# Altium schematic sheet MCU_STM32F407.SchDoc
size A3; DocumentNumber: 7; SheetNumber: 6; SheetTotal: 6
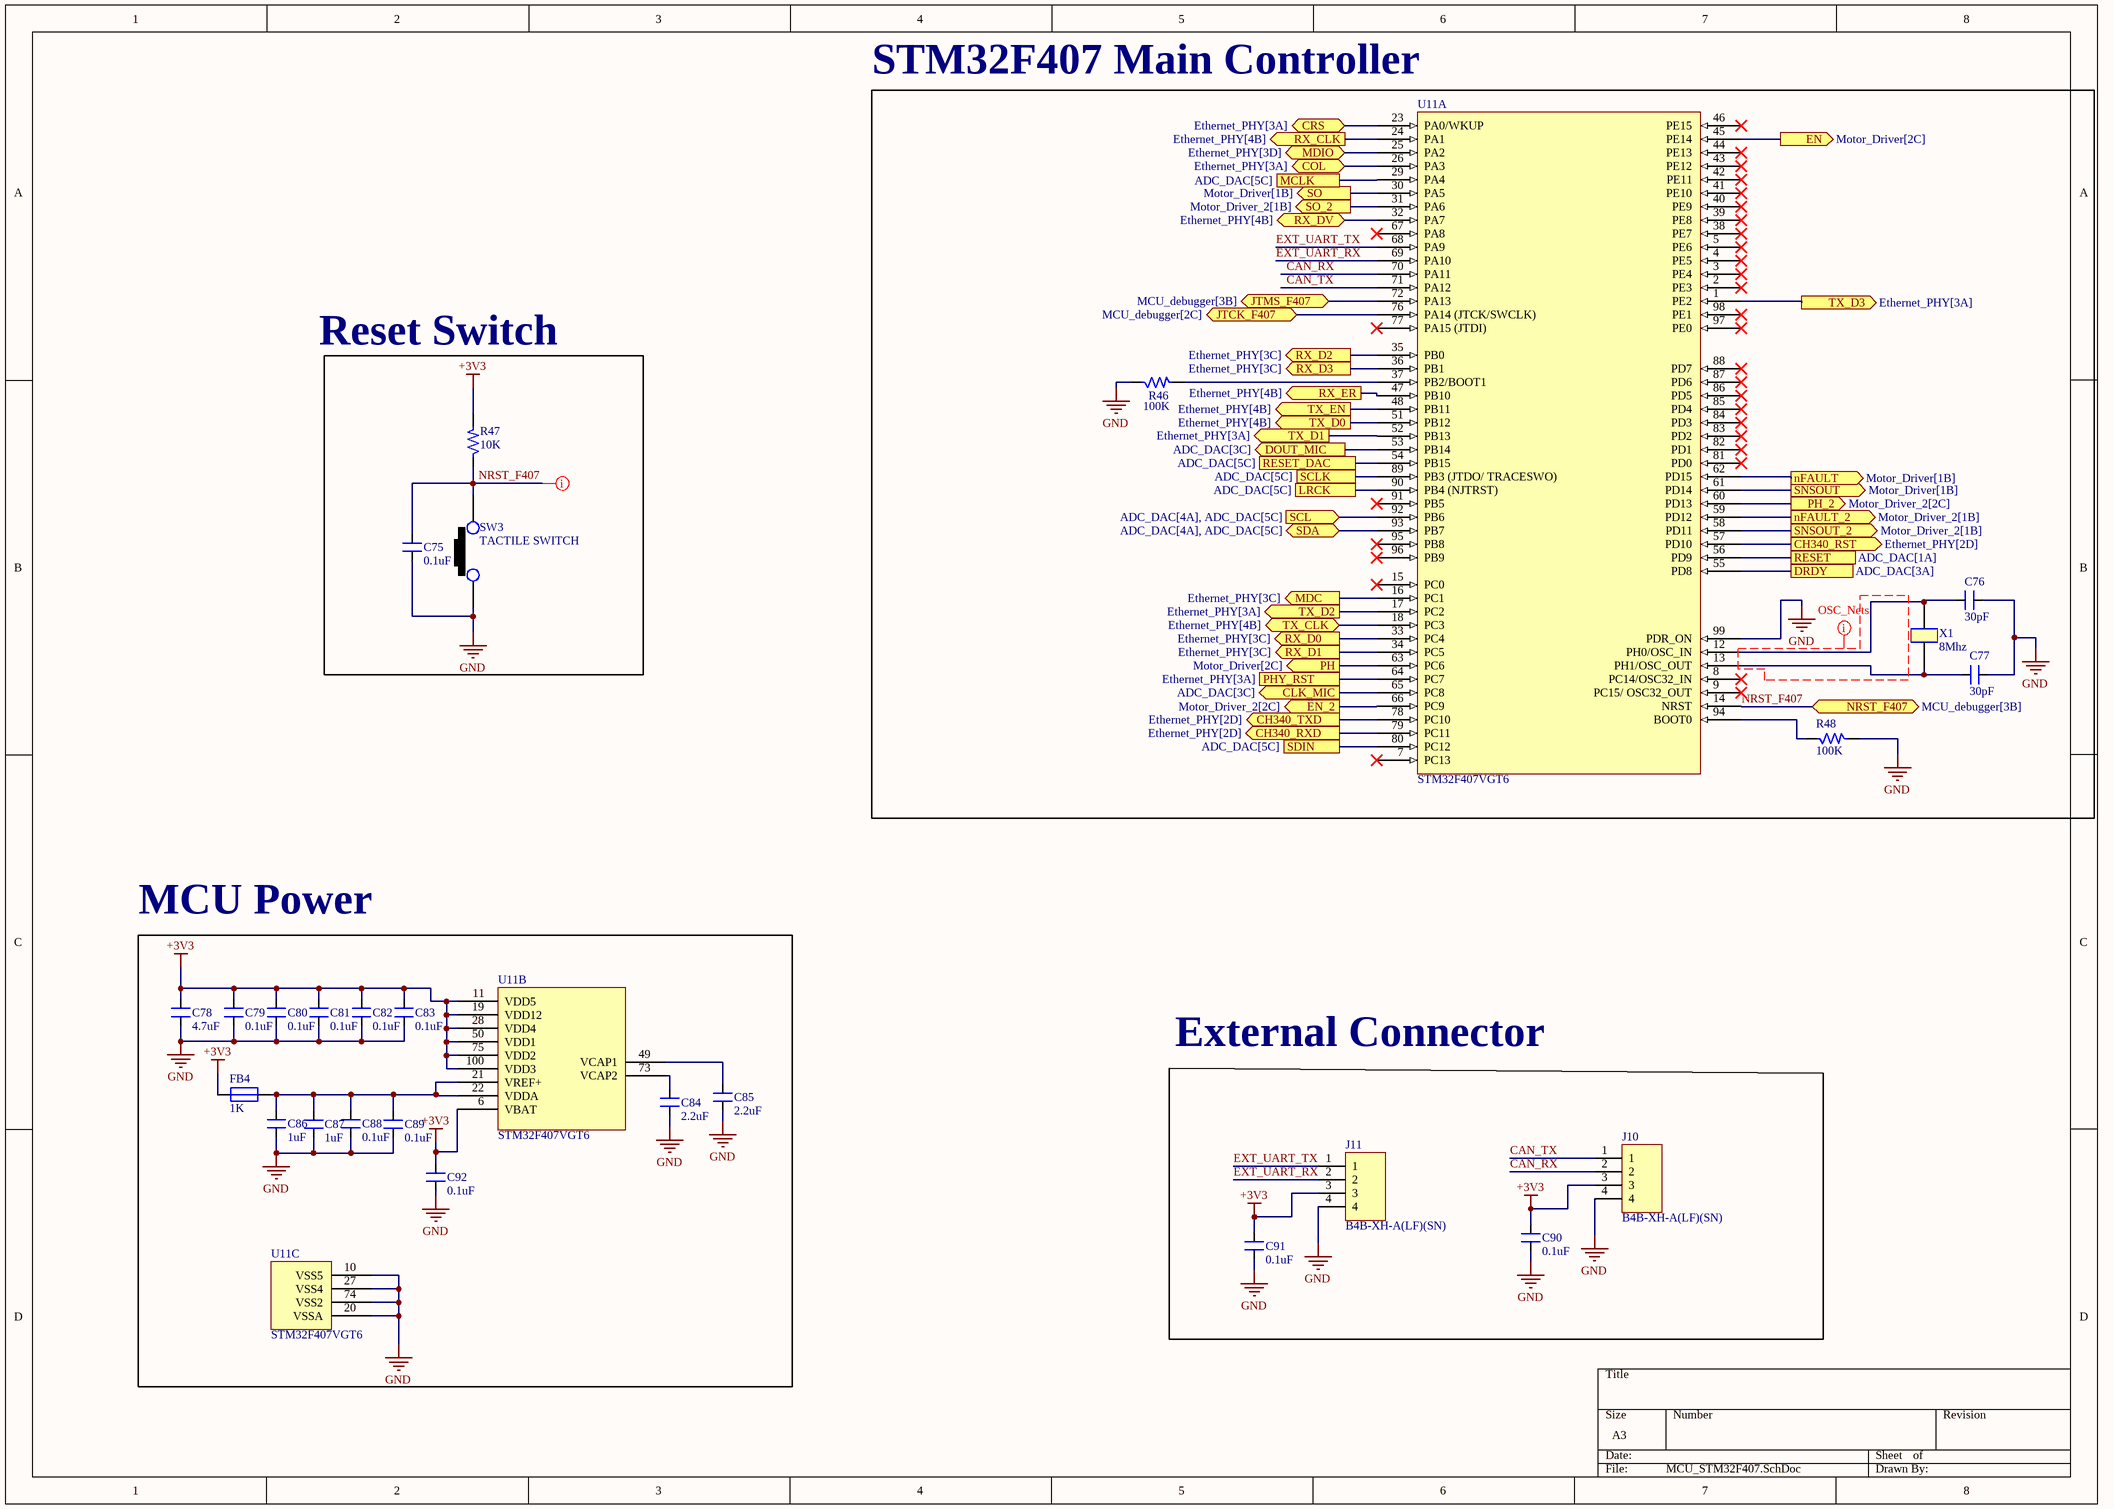
[diagram p0: MCU_STM32F407.SchDoc]

## Parts
C75  0.1uF  [CAP_0805]
C76  30pF  [CAP_0805]
C77  30pF  [CAP_0805]
C78  4.7uF  [CAP_0805]
C79  0.1uF  [CAP_0805]
C80  0.1uF  [CAP_0805]
C81  0.1uF  [CAP_0805]
C82  0.1uF  [CAP_0805]
C83  0.1uF  [CAP_0805]
C84  2.2uF  [CAP_0805]
C85  2.2uF  [CAP_0805]
C86  1uF  [CAP_0805]
C87  1uF  [CAP_0805]
C88  0.1uF  [CAP_0805]
C89  0.1uF  [CAP_0805]
C90  0.1uF  [CAP_0805]
C91  0.1uF  [CAP_0805]
C92  0.1uF  [CAP_0805]
FB4  1K  [IND_0805]
J10  B4B-XH-A(LF)(SN)  [CON4_100_B4B-XH-A_TH_ST]
J11  B4B-XH-A(LF)(SN)  [CON4_100_B4B-XH-A_TH_ST]
R46  100K  [RES_0603]
R47  10K  [RES_0603]
R48  100K  [RES_0603]
SW3  TACTILE SWITCH  [SW_342_SMD]
U11  STM32F407VGT6  [QFN100_19.6_669_58X10_SMD]  (parts A,B,C of 3)
X1  8Mhz  [XTAL_314_240X47_SMD]

## Blocks framed on the sheet
STM32F407 Main Controller: C76 C77 R46 R48 U11 X1
MCU Power: C78-C89 C92 FB4 U11
External Connector: C90 C91 J10 J11

## Ports
CH340_RST (out, see Ethernet_PHY[2D]), CH340_RXD (out, see Ethernet_PHY[2D]), CH340_TXD (out, see Ethernet_PHY[2D]), CLK_MIC (out, see ADC_DAC[3C]), COL (bidir, see Ethernet_PHY[3A]), CRS (bidir, see Ethernet_PHY[3A]), DOUT_MIC (out, see ADC_DAC[3C]), DRDY (see ADC_DAC[3A]), EN (out, see Motor_Driver[2C]), EN_2 (out, see Motor_Driver_2[2C]), JTCK_F407 (bidir, see MCU_debugger[2C]), JTMS_F407 (bidir, see MCU_debugger[3B]), LRCK (see ADC_DAC[5C]), MCLK (see ADC_DAC[5C]), MDC (out, see Ethernet_PHY[3C]), MDIO (bidir, see Ethernet_PHY[3D]), nFAULT (out, see Motor_Driver[1B]), nFAULT_2 (out, see Motor_Driver_2[1B]), NRST_F407 (bidir, see MCU_debugger[3B]), PH (out, see Motor_Driver[2C]), PH_2 (out, see Motor_Driver_2[2C]), PHY_RST (see Ethernet_PHY[3A]), RESET (see ADC_DAC[1A]), RESET_DAC (see ADC_DAC[5C]), RX_CLK (out, see Ethernet_PHY[4B]), RX_D0 (out, see Ethernet_PHY[3C]), RX_D1 (out, see Ethernet_PHY[3C]), RX_D2 (out, see Ethernet_PHY[3C]), RX_D3 (out, see Ethernet_PHY[3C]), RX_DV (bidir, see Ethernet_PHY[4B]), RX_ER (out, see Ethernet_PHY[4B]), SCL (in, see ADC_DAC[4A], ADC_DAC[5C]), SCLK (see ADC_DAC[5C]), SDA (bidir, see ADC_DAC[4A], ADC_DAC[5C]), SDIN (see ADC_DAC[5C]), SNSOUT (out, see Motor_Driver[1B]), SNSOUT_2 (out, see Motor_Driver_2[1B]), SO (out, see Motor_Driver[1B]), SO_2 (out, see Motor_Driver_2[1B]), TX_CLK (bidir, see Ethernet_PHY[4B]), TX_D0 (out, see Ethernet_PHY[4B]), TX_D1 (out, see Ethernet_PHY[3A]), TX_D2 (out, see Ethernet_PHY[3A]), TX_D3 (out, see Ethernet_PHY[3A]), TX_EN (out, see Ethernet_PHY[4B])

## Nets
+3V3: C78.2 C79.2 C80.2 C81.2 C82.2 C83.2 C90.2 C91.2 C92.2 FB4.1 J10.3 J11.3 R47.2 U11.6(VBAT) U11.11(VDD5) U11.19(VDD12) U11.28(VDD4) U11.50(VDD1) U11.75(VDD2) U11.100(VDD3)
GND: C75.1 C76.2 C77.2 C78.1 C79.1 C80.1 C81.1 C82.1 C83.1 C84.1 C85.1 C86.1 C87.1 C88.1 C89.1 C90.1 C91.1 C92.1 J10.4 J11.4 R46.1 R48.2 SW3.1 U11.10(VSS5) U11.20(VSSA) U11.27(VSS4) U11.74(VSS2) U11.99(PDR_ON)
CAN_RX: J10.2 U11.70(PA11)
CAN_TX: J10.1 U11.71(PA12)
CH340_RST: U11.57(PD10) ; port CH340_RST
CH340_RXD: U11.79(PC11) ; port CH340_RXD
CH340_TXD: U11.78(PC10) ; port CH340_TXD
CLK_MIC: U11.65(PC8) ; port CLK_MIC
COL: U11.26(PA3) ; port COL
CRS: U11.23(PA0/WKUP) ; port CRS
DOUT_MIC: U11.53(PB14) ; port DOUT_MIC
DRDY: U11.55(PD8) ; port DRDY
EN: U11.45(PE14) ; port EN
EN_2: U11.66(PC9) ; port EN_2
EXT_UART_RX: J11.2 U11.69(PA10)
EXT_UART_TX: J11.1 U11.68(PA9)
JTCK_F407: U11.76(PA14_(JTCK/SWCLK)) ; port JTCK_F407
JTMS_F407: U11.72(PA13) ; port JTMS_F407
LRCK: U11.90(PB4_(NJTRST)) ; port LRCK
MCLK: U11.29(PA4) ; port MCLK
MDC: U11.16(PC1) ; port MDC
MDIO: U11.25(PA2) ; port MDIO
nFAULT: U11.62(PD15) ; port nFAULT
nFAULT_2: U11.59(PD12) ; port nFAULT_2
NRST_F407: C75.2 R47.1 SW3.2 U11.14(NRST) ; port NRST_F407
PH: U11.63(PC6) ; port PH
PH_2: U11.60(PD13) ; port PH_2
PHY_RST: U11.64(PC7) ; port PHY_RST
RESET: U11.56(PD9) ; port RESET
RESET_DAC: U11.54(PB15) ; port RESET_DAC
RX_CLK: U11.24(PA1) ; port RX_CLK
RX_D0: U11.33(PC4) ; port RX_D0
RX_D1: U11.34(PC5) ; port RX_D1
RX_D2: U11.35(PB0) ; port RX_D2
RX_D3: U11.36(PB1) ; port RX_D3
RX_DV: U11.32(PA7) ; port RX_DV
RX_ER: U11.47(PB10) ; port RX_ER
SCL: U11.92(PB6) ; port SCL
SCLK: U11.89(PB3_(JTDO/_TRACESWO)) ; port SCLK
SDA: U11.93(PB7) ; port SDA
SDIN: U11.80(PC12) ; port SDIN
SNSOUT: U11.61(PD14) ; port SNSOUT
SNSOUT_2: U11.58(PD11) ; port SNSOUT_2
SO: U11.30(PA5) ; port SO
SO_2: U11.31(PA6) ; port SO_2
TX_CLK: U11.18(PC3) ; port TX_CLK
TX_D0: U11.51(PB12) ; port TX_D0
TX_D1: U11.52(PB13) ; port TX_D1
TX_D2: U11.17(PC2) ; port TX_D2
TX_D3: U11.1(PE2) ; port TX_D3
TX_EN: U11.48(PB11) ; port TX_EN
NetC76_1: C76.1 U11.12(PH0/OSC_IN) X1.2
NetC77_1: C77.1 U11.13(PH1/OSC_OUT) X1.1
NetC84_2: C84.2 U11.73(VCAP2)
NetC85_2: C85.2 U11.49(VCAP1)
NetC86_2: C86.2 C87.2 C88.2 C89.2 FB4.2 U11.21(VREF+) U11.22(VDDA)
NetR46_2: R46.2 U11.37(PB2/BOOT1)
NetR48_1: R48.1 U11.94(BOOT0)

Not connected (* = marked no-connect by the designer): U11 2(PE3)* 3(PE4)* 4(PE5)* 5(PE6)* 7(PC13)* 8(PC14/OSC32_IN)* 9(PC15/_OSC32_OUT)* 15(PC0)* 38(PE7)* 39(PE8)* 40(PE9)* 41(PE10)* 42(PE11)* 43(PE12)* 44(PE13)* 46(PE15)* 67(PA8)* 77(PA15_(JTDI))* 81(PD0)* 82(PD1)* 83(PD2)* 84(PD3)* 85(PD4)* 86(PD5)* 87(PD6)* 88(PD7)* 91(PB5)* 95(PB8)* 96(PB9)* 97(PE0)* 98(PE1)*

## Layout directives
net class OSC_Nets: GND
net class Critical Nets: NRST_F407

## Notes on the sheet
- Reset Switch

## Library data of the parts
C75 C79-C83 C88-C92 = CAP_0.1uF-50V-10%-0805: 0.1µF ±10% 50V Ceramic Capacitor X7R 0805 (2012 Metric); Manufacturer: Samsung; Manufacturer Part Number: CL21B104KBCNNNC; Alternate Part Number-1: NA; Case/Package: 0805; Supplier-1: SIRICOM; Supplier Part Number-1: 0805B104K500CT
C76 C77 = CAP_30pF-50V-10%-0805: ±10% 50V Ceramic Capacitor C0G, NP0 0805 (2012 Metric); Manufacturer Part Number: C0805C300K5GAC7800; Manufacturer: KEMET; Alternate Part Number: NA; Case/Package: 0805; Supplier-1: Digikey; Supplier Part Number-1: 399-17443-1-ND - Cut Tape (CT)
C78 = CAP_4.7uF-50V-10%-0805: 4.7µF ±10% 50V Ceramic Capacitor X5R 0805 (2012 Metric); Manufacturer: Yageo; Manufacturer Part Number: GRM21BR61H475KE51L; Alternate Part Number-1: NA; Case/Package: 0805; Supplier-1: SIRICOM; Supplier Part Number-1: CL21A475KBQNNNE
C84 C85 = CAP_2.2uF-25V-10%-0805: 2.2µF ±10% 25V Ceramic Capacitor X7R 0805 (2012 Metric); Manufacturer: KEMET; Manufacturer Part Number: CL21B225KAFNFNE; Alternate Part Number-1: NA; Case/Package: 0805; Supplier-1: SIRICOM; Supplier Part Number-1: CL21A225KAFNNNE
C86 C87 = CAP_1uF-50V-5%-0805: 1µF ±5% 50V Ceramic Capacitor X7R 0805 (2012 Metric); Manufacturer: Samsung; Manufacturer Part Number: CC0805JKX7R9BB105; Alternate Part Number-1: 0805F105M500NT; Case/Package: 0805; Supplier-1: SIRICOM; Supplier Part Number-1: CL21B105KBFNNNE
FB4 = FB_1K-100MHZ-1.6A-0805: 1 kOhms @ 100MHz 1 Power Line Ferrite Bead 0805 (2012 Metric) 1.6A; Manufacturer: Laird; Manufacturer Part Number: BLM21SP102SH1D; Alternate Part Number-1: NA; Case/Package: 0805; Supplier-1: SIRICOM; Supplier Part Number-1: ACMS201209A102
J10 J11 = CON-PLG_4X1-100-ST-TH: 4 Pins, 1 Row 2.54mm Pitch, straight Connector, male; Manufacturer: Wurth Electronics; Mating Part Number: XHP-4; Crimp Part Number: ASXHSXH22K51; Alternate Part Number-1: NA; Manufacturer Part Number: B4B-XH-A(LF)(SN); Case/Package: TH-CON; Supplier-1: LCSC; Supplier Part Number-1: B4B-XH-A(LF)(SN)
R46 R48 = RES_100K-0.1W-1%-0603: 100 kOhms ±1% 0.1W, 1/10W Chip Resistor 0603 (1608 Metric) Automotive AEC-Q200 Thick Film; Manufacturer: Stackpole Electronics; Manufacturer Part Number: RMCF0603FT100K; Alternate Part Number-1: NA; Case/Package: 0603; Supplier-1: Arrow; Supplier Part Number-1: RMCF0603FT100K
R47 = RES_10K-0.1W-1%-0603: 10 kOhms ±1% 0.1W, 1/10W Chip Resistor 0603 (1608 Metric) Automotive AEC-Q200 Thick Film; Manufacturer: Walsin; Manufacturer Part Number: WR06X1002FTL; Alternate Part Number-1: 0603WAJ0103T5E; Case/Package: 0603; Supplier-1: SIRICOM; Supplier Part Number-1: WR06X1002FTL
SW3 = SW1_RS-282G05A3-SMRT-SMD: Tactile Switch SPST-NO Top Actuated Surface Mount; Manufacturer: ITT C&K; Alternate Part Number-1: NA; Manufacturer Part Number: RS-282G05A3-SMRT; Case/Package: SMD; Supplier-1: SP ROAD; Supplier Part Number-1: RS-282G05A3-SMRT
U11 = IC_STM32F407VGT6: ARM® Cortex®-M4 STM32F4 Microcontroller IC 32-Bit 168MHz 1MB (1M x 8) FLASH 100-LQFP (14x14); Manufacturer: STMicroelectronics; Alternate Part Number-1: STM32F407VET6; Manufacturer Part Number: STM32F407VGT6; Case/Package: LQFP100; Supplier-1: ARROW; Supplier Part Number-1: STM32F407VGT6
X1 = XTAL_8MHZ-ECS-80-32-5PX-SMD: 8MHz ±30ppm Crystal 32pF 60 Ohms HC-49/US; Manufacturer: Fox Electronics; Manufacturer Part Number: ECS-80-32-5PX-TR; Alternate Part Number-1: NA; Case/Package: SMD/SMT; Supplier-1: SP ROAD; Supplier Part Number-1: ECS-80-32-5PX-TR